# Altium schematic sheet aa8028.SCHDOC
size B
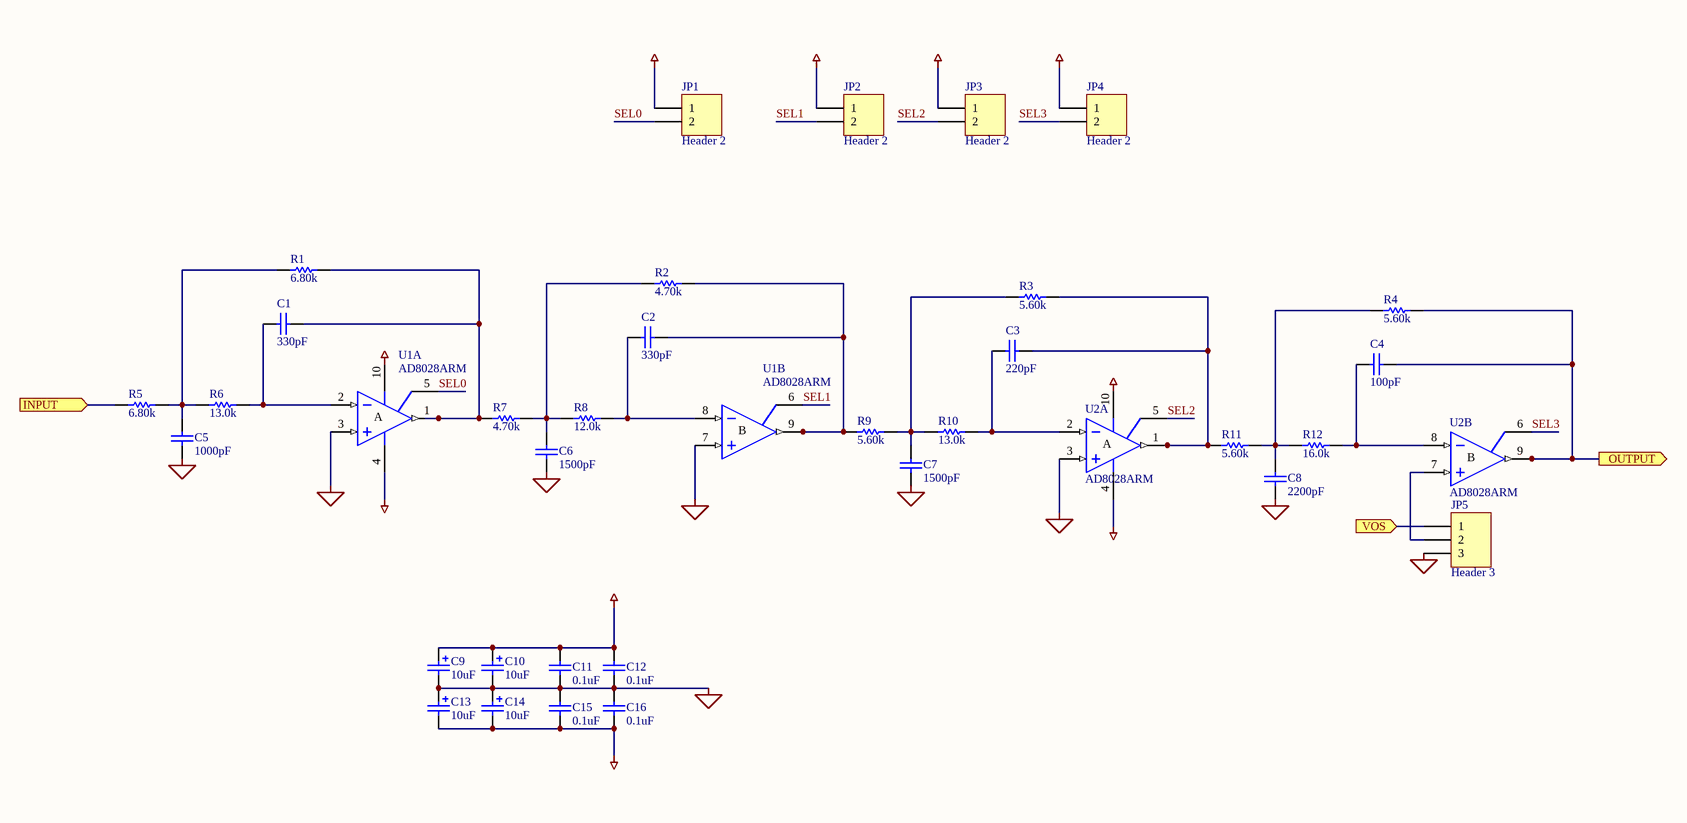
[diagram p0: aa8028.SCHDOC]

## Parts
C1  value 330pF  [0603]  (hidden comment: Cap)
C2  value 330pF  [0603]  (hidden comment: Cap)
C3  value 220pF  [0603]  (hidden comment: Cap)
C4  value 100pF  [0603]  (hidden comment: Cap)
C5  value 1000pF  [0603]  (hidden comment: Cap)
C6  value 1500pF  [0603]  (hidden comment: Cap)
C7  value 1500pF  [0603]  (hidden comment: Cap)
C8  value 2200pF  [0603]  (hidden comment: Cap)
C9  value 10uF  [TC3528-1411]  (hidden comment: Cap Pol1)
C10  value 10uF  [TC3528-1411]  (hidden comment: Cap Pol1)
C11  value 0.1uF  [CC1608-0603]  (hidden comment: Cap)
C12  value 0.1uF  [CC1608-0603]  (hidden comment: Cap)
C13  value 10uF  [TC3528-1411]  (hidden comment: Cap Pol1)
C14  value 10uF  [TC3528-1411]  (hidden comment: Cap Pol1)
C15  value 0.1uF  [CC1608-0603]  (hidden comment: Cap)
C16  value 0.1uF  [CC1608-0603]  (hidden comment: Cap)
JP1  Header 2  [HDR1X2]
JP2  Header 2  [HDR1X2]
JP3  Header 2  [HDR1X2]
JP4  Header 2  [HDR1X2]
JP5  Header 3  [HDR1X3]
R1  value 6.80k  [0603]  (hidden comment: Res1)
R2  value 4.70k  [0603]  (hidden comment: Res1)
R3  value 5.60k  [0603]  (hidden comment: Res1)
R4  value 5.60k  [0603]  (hidden comment: Res1)
R5  value 6.80k  [0603]  (hidden comment: Res1)
R6  value 13.0k  [0603]  (hidden comment: Res1)
R7  value 4.70k  [0603]  (hidden comment: Res1)
R8  value 12.0k  [0603]  (hidden comment: Res1)
R9  value 5.60k  [0603]  (hidden comment: Res1)
R10  value 13.0k  [0603]  (hidden comment: Res1)
R11  value 5.60k  [0603]  (hidden comment: Res1)
R12  value 16.0k  [0603]  (hidden comment: Res1)
U1  AD8028ARM  [TSSO3x5-G10]  (parts A,B of 2)
U2  AD8028ARM  [TSSO3x5-G10]  (parts A,B of 2)

## Ports
INPUT (in), OUTPUT (out), VOS (in)

## Nets
AGND: C5.1 C6.1 C7.1 C8.1 C9.2 C10.2 C11.1 C12.1 C13.1 C14.1 C15.2 C16.2 JP5.3 U1.3(IN+A) U1.7(IN+B) U2.3(IN+A)
AVDD: C9.1 C10.1 C11.2 C12.2 JP1.1 JP2.1 JP3.1 JP4.1 U1.10(V+) U2.10(V+)
AVSS: C13.2 C14.2 C15.1 C16.1 U1.4(V-) U2.4(V-)
INPUT: R5.1 ; port INPUT
OUTPUT: C4.1 R4.1 U2.9(VOUTB) ; port OUTPUT
SEL0: JP1.2 U1.5(SELA)
SEL1: JP2.2 U1.6(SELB)
SEL2: JP3.2 U2.5(SELA)
SEL3: JP4.2 U2.6(SELB)
VOS: JP5.1 ; port VOS
NetC1_1: C1.1 R1.1 R7.1 U1.1(VOUTA)
NetC1_2: C1.2 R6.2 U1.2(IN-A)
NetC2_1: C2.1 R2.1 R9.1 U1.9(VOUTB)
NetC2_2: C2.2 R8.2 U1.8(IN-B)
NetC3_1: C3.1 R3.1 R11.1 U2.1(VOUTA)
NetC3_2: C3.2 R10.2 U2.2(IN-A)
NetC4_2: C4.2 R12.2 U2.8(IN-B)
NetC5_2: C5.2 R1.2 R5.2 R6.1
NetC6_2: C6.2 R2.2 R7.2 R8.1
NetC7_2: C7.2 R3.2 R9.2 R10.1
NetC8_2: C8.2 R4.2 R11.2 R12.1
NetJP5_2: JP5.2 U2.7(IN+B)

## Notes on the sheet
- (in symbol AD8028ARM, part A) A
- (in symbol AD8028ARM, part B) B

## Library data of the parts
C1-C8 C11 C12 C15 C16 = Cap: Capacitor; Manufacturer: Generic Components; Class I: Passive; Published: 8-Jun-2000; Revision: July-2002: Re-released for DXP Platform.; Publisher: Altium Limited; Class II: Capacitor
C9 C10 C13 C14 = Cap Pol1: Polarized Capacitor (Radial); Manufacturer: Generic Components; Class I: Passive; Published: 8-Jun-2000; Revision: July-2002: Re-released for DXP Platform.; Publisher: Altium Limited; Class II: Capacitor
JP1-JP4 = Header 2: Header, 2-Pin; Manufacturer: Generic Components; Class I: Connector; Revision: July-2002: Re-released for DXP Platform.; Publisher: Altium Limited
JP5 = Header 3: Header, 3-Pin; Manufacturer: Generic Components; Class I: Connector; Revision: July-2002: Re-released for DXP Platform.; Publisher: Altium Limited
R1-R12 = Res1: Resistor; Manufacturer: Generic Components; Class I: Passive; Published: 8-Jun-2000; Revision: July-2002: Re-released for DXP Platform.; Publisher: Altium Limited; Class II: Resistor
U1 U2 = AD8028ARM: Analog Devices Low Distortion, High Speed RRIO OA